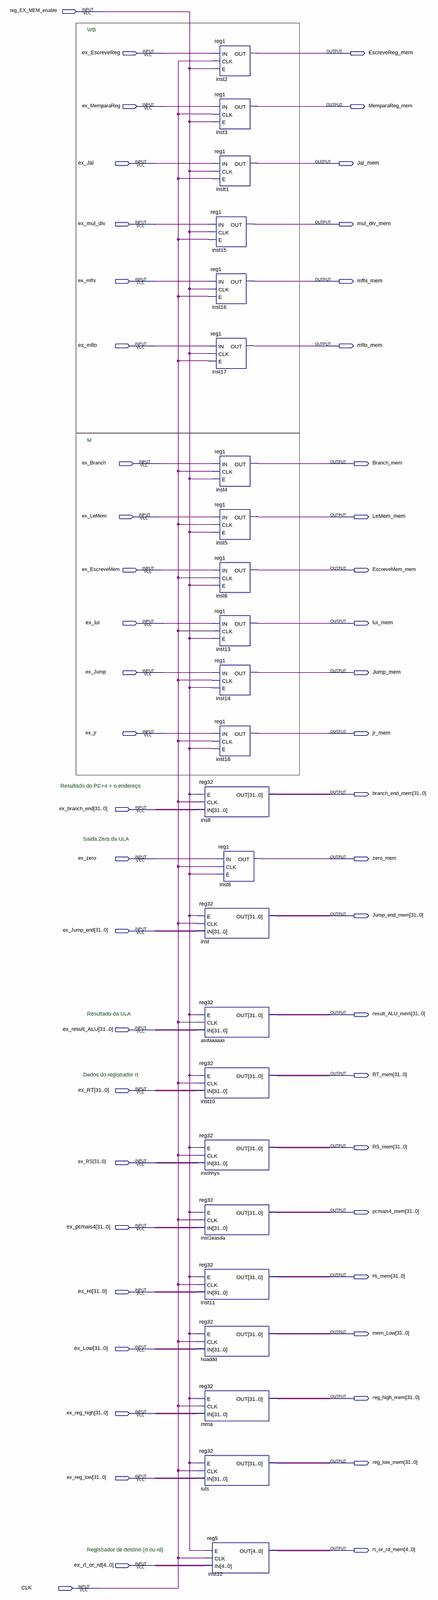
[diagram p0: schematic sheet, whole]
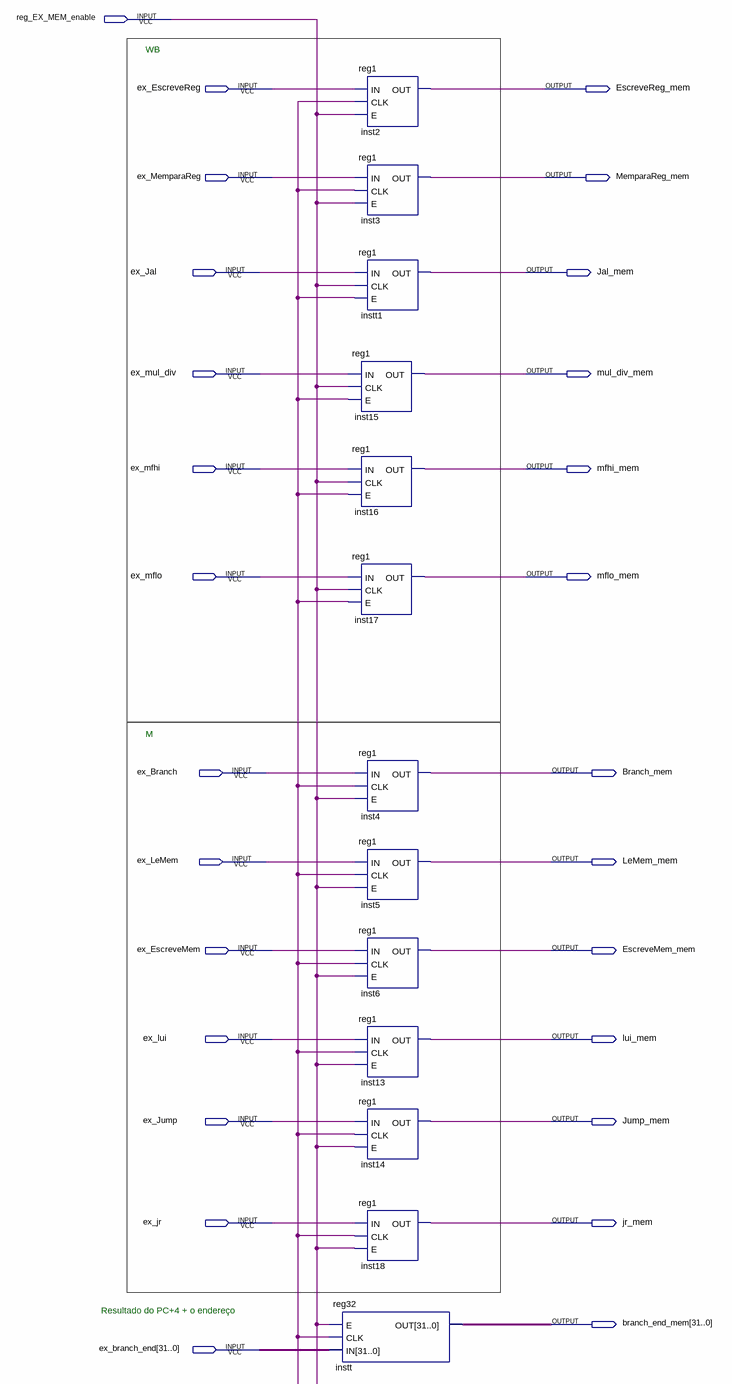
[diagram p1: schematic sheet, upper part]
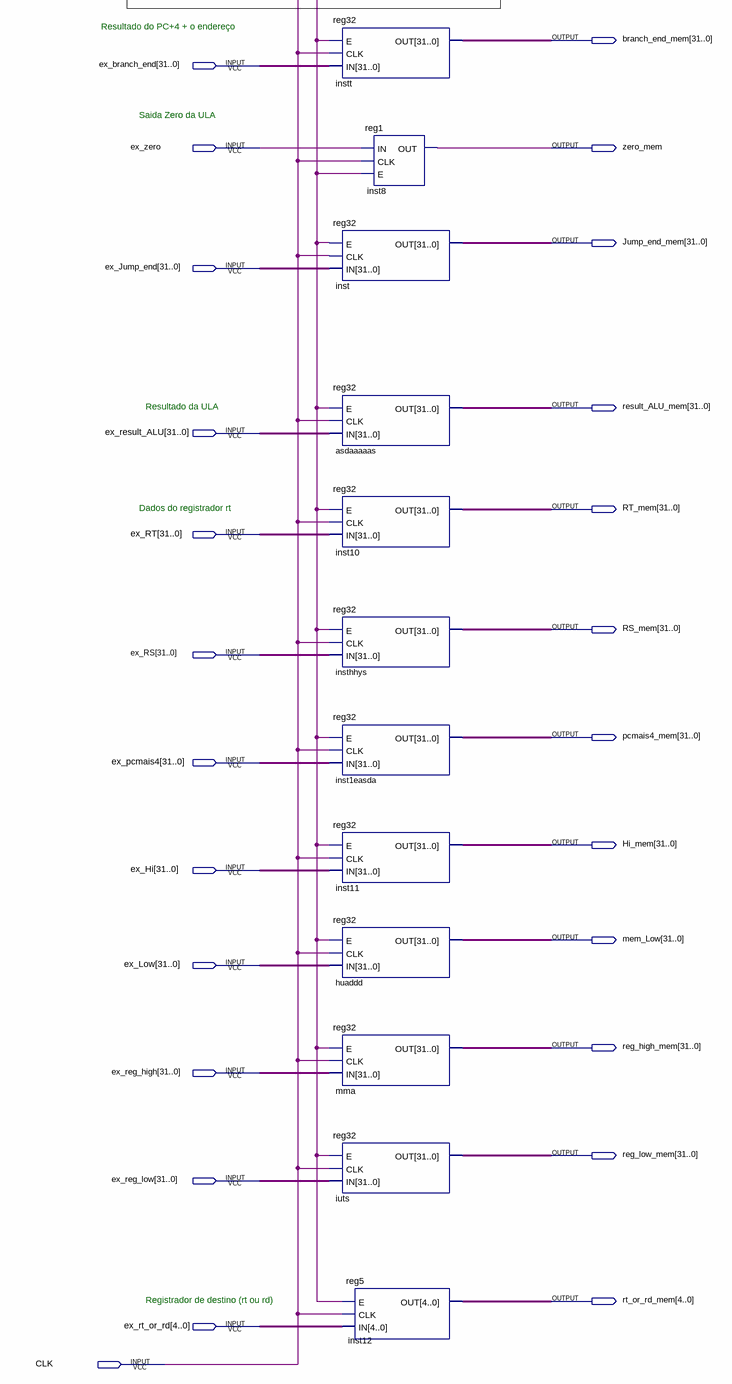
[diagram p2: schematic sheet, lower part]
// Quartus schematic reg_EX-MEM.bdf as structural Verilog: 24 symbols, 50 pins
module \reg_EX-MEM  (
  input  reg_EX_MEM_enable,
  input  ex_EscreveReg,
  input  ex_MemparaReg,
  input  ex_Jal,
  input  ex_mul_div,
  input  ex_mfhi,
  input  ex_mflo,
  input  ex_Branch,
  input  ex_LeMem,
  input  ex_EscreveMem,
  input  ex_lui,
  input  ex_Jump,
  input  ex_jr,
  input  [31:0] ex_branch_end,
  input  ex_zero,
  input  [31:0] ex_Jump_end,
  input  [31:0] ex_result_ALU,
  input  [31:0] ex_RT,
  input  [31:0] ex_RS,
  input  [31:0] ex_pcmais4,
  input  [31:0] ex_Hi,
  input  [31:0] ex_Low,
  input  [31:0] ex_reg_high,
  input  [31:0] ex_reg_low,
  input  [4:0] ex_rt_or_rd,
  input  CLK,
  output EscreveReg_mem,
  output MemparaReg_mem,
  output Jal_mem,
  output mul_div_mem,
  output mfhi_mem,
  output mflo_mem,
  output Branch_mem,
  output LeMem_mem,
  output EscreveMem_mem,
  output lui_mem,
  output Jump_mem,
  output jr_mem,
  output [31:0] branch_end_mem,
  output zero_mem,
  output [31:0] Jump_end_mem,
  output [31:0] result_ALU_mem,
  output [31:0] RT_mem,
  output [31:0] RS_mem,
  output [31:0] pcmais4_mem,
  output [31:0] Hi_mem,
  output [31:0] mem_Low,
  output [31:0] reg_high_mem,
  output [31:0] reg_low_mem,
  output [4:0] rt_or_rd_mem
);

  reg1 inst2 (.IN(ex_EscreveReg), .CLK(CLK), .E(reg_EX_MEM_enable), .OUT(EscreveReg_mem));
  reg1 inst3 (.IN(ex_MemparaReg), .CLK(CLK), .E(reg_EX_MEM_enable), .OUT(MemparaReg_mem));
  reg1 instt1 (.IN(ex_Jal), .CLK(reg_EX_MEM_enable), .E(CLK), .OUT(Jal_mem));
  reg1 inst15 (.IN(ex_mul_div), .CLK(reg_EX_MEM_enable), .E(CLK), .OUT(mul_div_mem));
  reg1 inst16 (.IN(ex_mfhi), .CLK(reg_EX_MEM_enable), .E(CLK), .OUT(mfhi_mem));
  reg1 inst17 (.IN(ex_mflo), .CLK(reg_EX_MEM_enable), .E(CLK), .OUT(mflo_mem));
  reg1 inst4 (.IN(ex_Branch), .CLK(CLK), .E(reg_EX_MEM_enable), .OUT(Branch_mem));
  reg1 inst5 (.IN(ex_LeMem), .CLK(CLK), .E(reg_EX_MEM_enable), .OUT(LeMem_mem));
  reg1 inst6 (.IN(ex_EscreveMem), .CLK(CLK), .E(reg_EX_MEM_enable), .OUT(EscreveMem_mem));
  reg1 inst13 (.IN(ex_lui), .CLK(CLK), .E(reg_EX_MEM_enable), .OUT(lui_mem));
  reg1 inst14 (.IN(ex_Jump), .CLK(CLK), .E(reg_EX_MEM_enable), .OUT(Jump_mem));
  reg1 inst18 (.IN(ex_jr), .CLK(CLK), .E(reg_EX_MEM_enable), .OUT(jr_mem));
  reg32 instt (.E(reg_EX_MEM_enable), .CLK(CLK), .IN(ex_branch_end), .OUT(branch_end_mem));
  reg1 inst8 (.IN(ex_zero), .CLK(CLK), .E(reg_EX_MEM_enable), .OUT(zero_mem));
  reg32 inst (.E(reg_EX_MEM_enable), .CLK(CLK), .IN(ex_Jump_end), .OUT(Jump_end_mem));
  reg32 asdaaaaas (.E(reg_EX_MEM_enable), .CLK(CLK), .IN(ex_result_ALU), .OUT(result_ALU_mem));
  reg32 inst10 (.E(reg_EX_MEM_enable), .CLK(CLK), .IN(ex_RT), .OUT(RT_mem));
  reg32 insthhys (.E(reg_EX_MEM_enable), .CLK(CLK), .IN(ex_RS), .OUT(RS_mem));
  reg32 inst1easda (.E(reg_EX_MEM_enable), .CLK(CLK), .IN(ex_pcmais4), .OUT(pcmais4_mem));
  reg32 inst11 (.E(reg_EX_MEM_enable), .CLK(CLK), .IN(ex_Hi), .OUT(Hi_mem));
  reg32 huaddd (.E(reg_EX_MEM_enable), .CLK(CLK), .IN(ex_Low), .OUT(mem_Low));
  reg32 mma (.E(reg_EX_MEM_enable), .CLK(CLK), .IN(ex_reg_high), .OUT(reg_high_mem));
  reg32 iuts (.E(reg_EX_MEM_enable), .CLK(CLK), .IN(ex_reg_low), .OUT(reg_low_mem));
  reg5 inst12 (.E(reg_EX_MEM_enable), .CLK(CLK), .IN(ex_rt_or_rd), .OUT(rt_or_rd_mem));

  // Notes on the sheet:
  //   WB
  //   M
  //   Resultado do PC+4 + o endereço
  //   Saida Zero da ULA
  //   Resultado da ULA
  //   Dados do registrador rt
  //   Registrador de destino (rt ou rd)
endmodule
